# EAGLE schematic sboardnew (EAGLE 6.6.0)

## Sheet 1 of 5
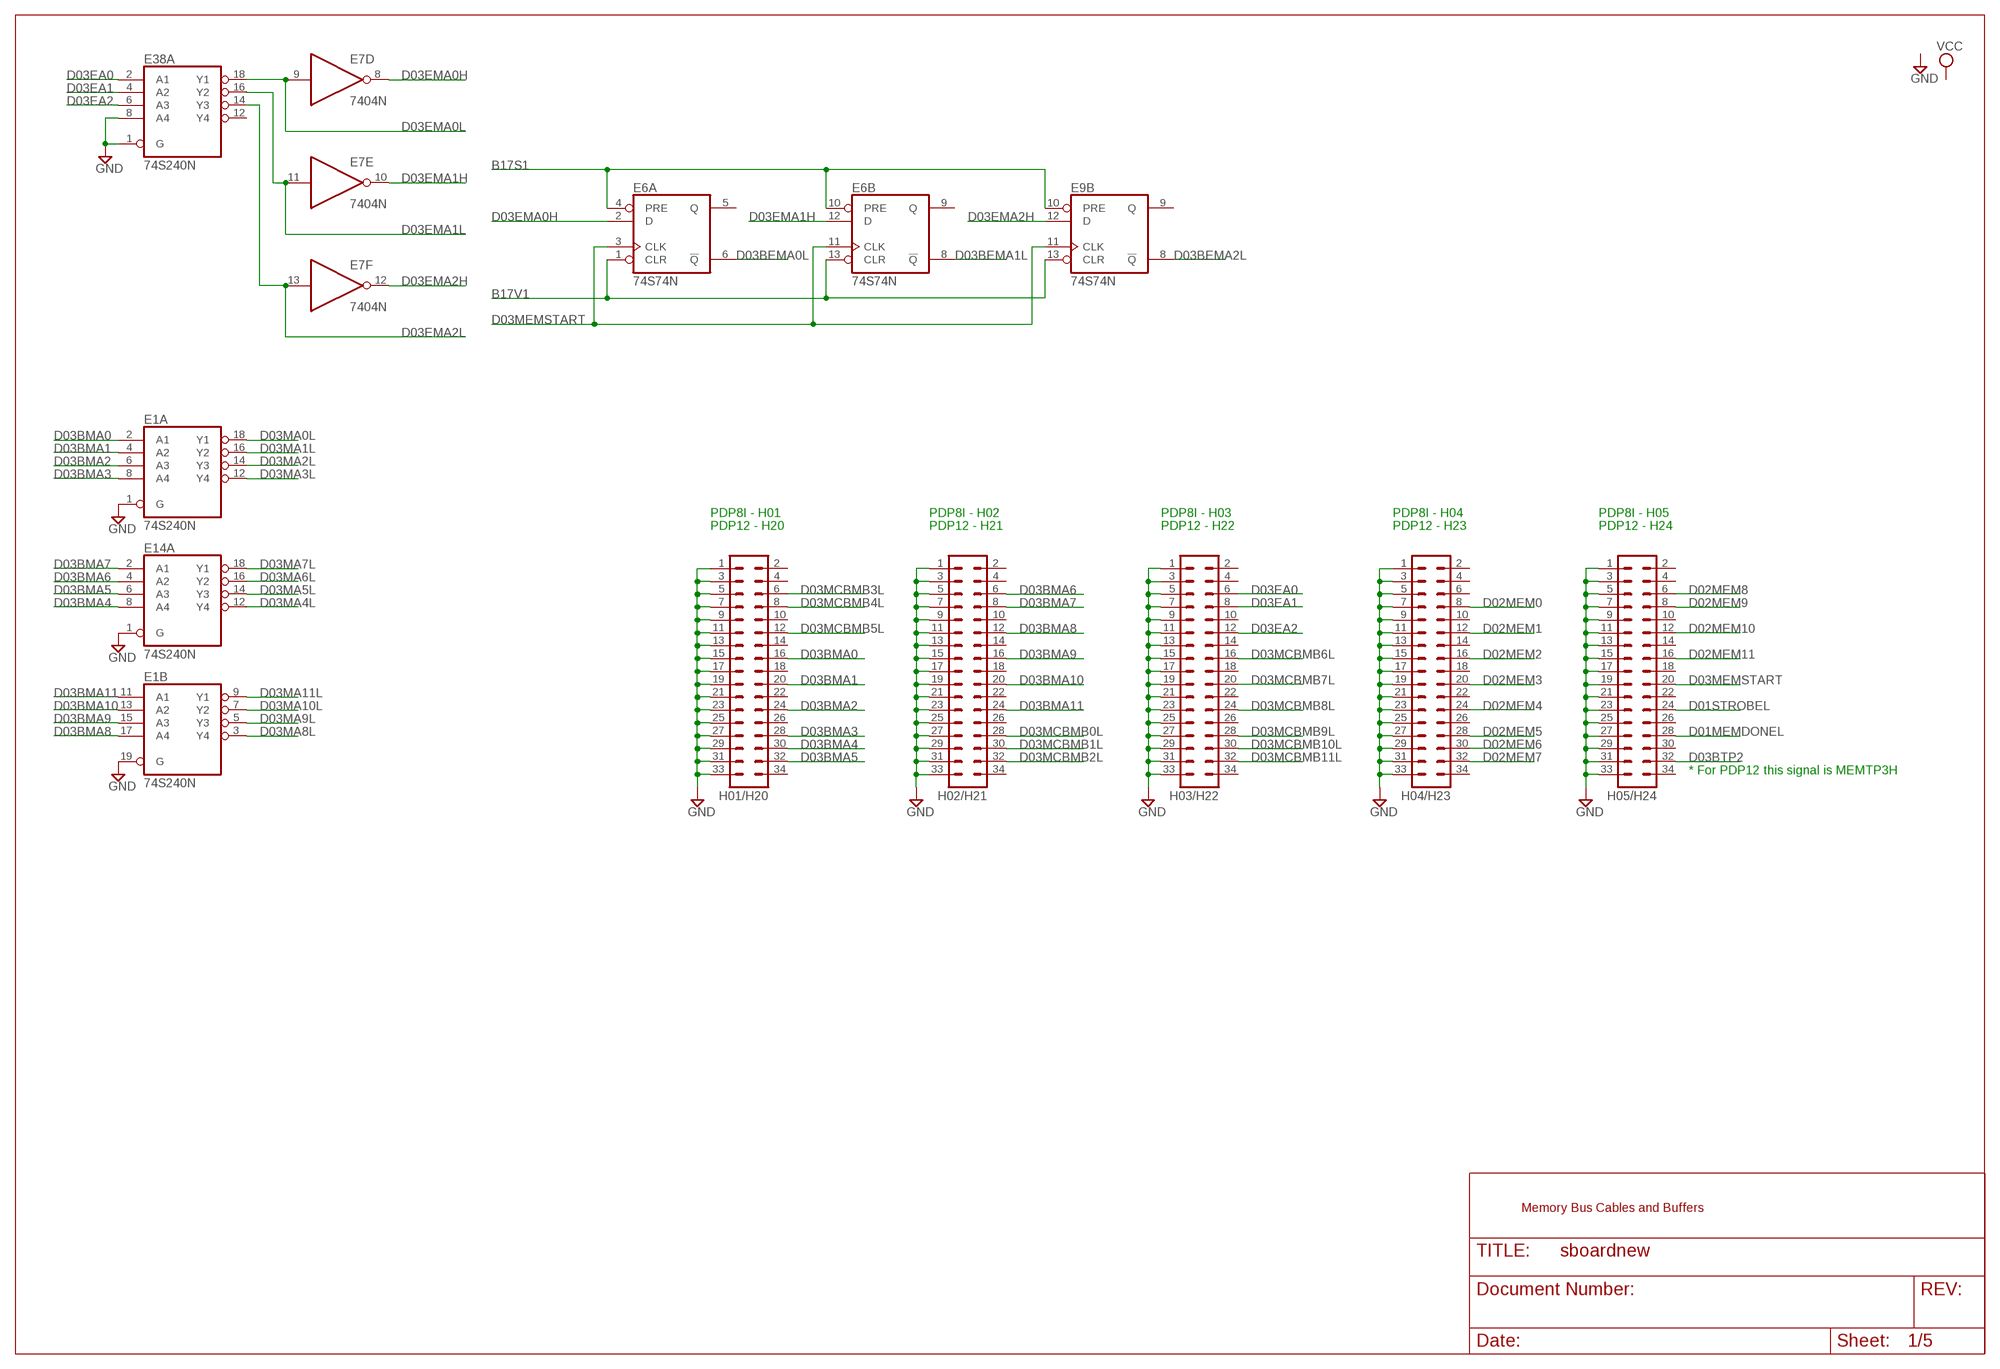
[diagram p0: schematic, sheet 1]

### Parts
E1  74S240N  [DIL20]
E6  74S74N  [DIL14]
E7  7404N  [DIL14]
E9  74S74N  [DIL14]
E14  74S240N  [DIL20]
E38  74S240N  [DIL20]
H01/H20  MA17-2  [MA17-2]
H02/H21  MA17-2  [MA17-2]
H03/H22  MA17-2  [MA17-2]
H04/H23  MA17-2  [MA17-2]
H05/H24  MA17-2  [MA17-2]

### Nets
B17S1: E6.4(A:PRE) E6.10(B:PRE) E9.10(B:PRE) ; also sheet 3,4
B17V1: E6.1(A:CLR) E6.13(B:CLR) E9.13(B:CLR) ; also sheet 3,4
D01MEMDONEL: H05/H24.28 ; also sheet 4
D01STROBEL: H05/H24.24 ; also sheet 4
D02MEM0: H04/H23.8 ; also sheet 3
D02MEM1: H04/H23.12 ; also sheet 3
D02MEM2: H04/H23.16 ; also sheet 3
D02MEM3: H04/H23.20 ; also sheet 3
D02MEM4: H04/H23.24 ; also sheet 3
D02MEM5: H04/H23.28 ; also sheet 3
D02MEM6: H04/H23.30 ; also sheet 3
D02MEM7: H04/H23.32 ; also sheet 3
D02MEM8: H05/H24.6 ; also sheet 3
D02MEM9: H05/H24.8 ; also sheet 3
D02MEM10: H05/H24.12 ; also sheet 3
D02MEM11: H05/H24.16 ; also sheet 3
D03BEMA0L: E6.6(A:!Q) ; also sheet 5
D03BEMA1L: E6.8(B:!Q) ; also sheet 5
D03BEMA2L: E9.8(B:!Q) ; also sheet 5
D03BMA0: E1.2(A:A1) H01/H20.16
D03BMA1: E1.4(A:A2) H01/H20.20
D03BMA2: E1.6(A:A3) H01/H20.24
D03BMA3: E1.8(A:A4) H01/H20.28
D03BMA4: E14.8(A:A4) H01/H20.30
D03BMA5: E14.6(A:A3) H01/H20.32
D03BMA6: E14.4(A:A2) H02/H21.6
D03BMA7: E14.2(A:A1) H02/H21.8
D03BMA8: E1.17(B:A4) H02/H21.12
D03BMA9: E1.15(B:A3) H02/H21.16
D03BMA10: E1.13(B:A2) H02/H21.20
D03BMA11: E1.11(B:A1) H02/H21.24
D03BTP2: H05/H24.32 ; also sheet 4
D03EA0: E38.2(A:A1) H03/H22.6
D03EA1: E38.4(A:A2) H03/H22.8
D03EA2: E38.6(A:A3) H03/H22.12
D03EMA0H: E6.2(A:D) E7.8(D:O) ; also sheet 4
D03EMA0L: E7.9(D:I) E38.18(A:Y1) ; also sheet 4
D03EMA1H: E6.12(B:D) E7.10(E:O) ; also sheet 4
D03EMA1L: E7.11(E:I) E38.16(A:Y2) ; also sheet 4
D03EMA2H: E7.12(F:O) E9.12(B:D) ; also sheet 4
D03EMA2L: E7.13(F:I) E38.14(A:Y3) ; also sheet 4
D03MA0L: E1.18(A:Y1) ; also sheet 5
D03MA1L: E1.16(A:Y2) ; also sheet 5
D03MA2L: E1.14(A:Y3) ; also sheet 5
D03MA3L: E1.12(A:Y4) ; also sheet 5
D03MA4L: E14.12(A:Y4) ; also sheet 5
D03MA5L: E14.14(A:Y3) ; also sheet 5
D03MA6L: E14.16(A:Y2) ; also sheet 5
D03MA7L: E14.18(A:Y1) ; also sheet 5
D03MA8L: E1.3(B:Y4) ; also sheet 5
D03MA9L: E1.5(B:Y3) ; also sheet 5
D03MA10L: E1.7(B:Y2) ; also sheet 5
D03MA11L: E1.9(B:Y1) ; also sheet 5
D03MCBMB0L: H02/H21.28 ; also sheet 2
D03MCBMB1L: H02/H21.30 ; also sheet 2
D03MCBMB2L: H02/H21.32 ; also sheet 2
D03MCBMB3L: H01/H20.6 ; also sheet 2
D03MCBMB4L: H01/H20.8 ; also sheet 2
D03MCBMB5L: H01/H20.12 ; also sheet 2
D03MCBMB6L: H03/H22.16 ; also sheet 2
D03MCBMB7L: H03/H22.20 ; also sheet 2
D03MCBMB8L: H03/H22.24 ; also sheet 2
D03MCBMB9L: H03/H22.28 ; also sheet 2
D03MCBMB10L: H03/H22.30 ; also sheet 2
D03MCBMB11L: H03/H22.32 ; also sheet 2
D03MEMSTART: E6.3(A:CLK) E6.11(B:CLK) E9.11(B:CLK) H05/H24.20 ; also sheet 4
GND [Power]: E1.1(A:G) E1.19(B:G) E14.1(A:G) E38.1(A:G) E38.8(A:A4) H01/H20.1 H01/H20.3 H01/H20.5 H01/H20.7 H01/H20.9 H01/H20.11 H01/H20.13 H01/H20.15 H01/H20.17 H01/H20.19 H01/H20.21 H01/H20.23 H01/H20.25 H01/H20.27 H01/H20.29 H01/H20.31 H01/H20.33 H02/H21.1 H02/H21.3 H02/H21.5 H02/H21.7 H02/H21.9 H02/H21.11 H02/H21.13 H02/H21.15 H02/H21.17 H02/H21.19 H02/H21.21 H02/H21.23 H02/H21.25 H02/H21.27 H02/H21.29 H02/H21.31 H02/H21.33 H03/H22.1 H03/H22.3 H03/H22.5 H03/H22.7 H03/H22.9 H03/H22.11 H03/H22.13 H03/H22.15 H03/H22.17 H03/H22.19 H03/H22.21 H03/H22.23 H03/H22.25 H03/H22.27 H03/H22.29 H03/H22.31 H03/H22.33 H04/H23.1 H04/H23.3 H04/H23.5 H04/H23.7 H04/H23.9 H04/H23.11 H04/H23.13 H04/H23.15 H04/H23.17 H04/H23.19 H04/H23.21 H04/H23.23 H04/H23.25 H04/H23.27 H04/H23.29 H04/H23.31 H04/H23.33 H05/H24.1 H05/H24.3 H05/H24.5 H05/H24.7 H05/H24.9 H05/H24.11 H05/H24.13 H05/H24.15 H05/H24.17 H05/H24.19 H05/H24.21 H05/H24.23 H05/H24.25 H05/H24.27 H05/H24.29 H05/H24.31 H05/H24.33 ; also sheet 3,4,5
Unconnected: E6.5(A:Q) E6.9(B:Q) E9.9(B:Q) E38.12(A:Y4) H01/H20.2 H01/H20.4 H01/H20.10 H01/H20.14 H01/H20.18 H01/H20.22 H01/H20.26 H01/H20.34 H02/H21.2 H02/H21.4 H02/H21.10 H02/H21.14 H02/H21.18 H02/H21.22 H02/H21.26 H02/H21.34 H03/H22.2 H03/H22.4 H03/H22.10 H03/H22.14 H03/H22.18 H03/H22.22 H03/H22.26 H03/H22.34 H04/H23.2 H04/H23.4 H04/H23.6 H04/H23.10 H04/H23.14 H04/H23.18 H04/H23.22 H04/H23.26 H04/H23.34 H05/H24.2 H05/H24.4 H05/H24.10 H05/H24.14 H05/H24.18 H05/H24.22 H05/H24.26 H05/H24.30 H05/H24.34

### Notes on the sheet
- PDP8I - H01 | PDP8I - H02 | PDP8I - H03 | PDP8I - H04 | PDP8I - H05
- PDP12 - H20 | PDP12 - H21 | PDP12 - H22 | PDP12 - H23 | PDP12 - H24
- * For PDP12 this signal is MEMTP3H
- Memory Bus Cables and Buffers

## Sheet 2 of 5
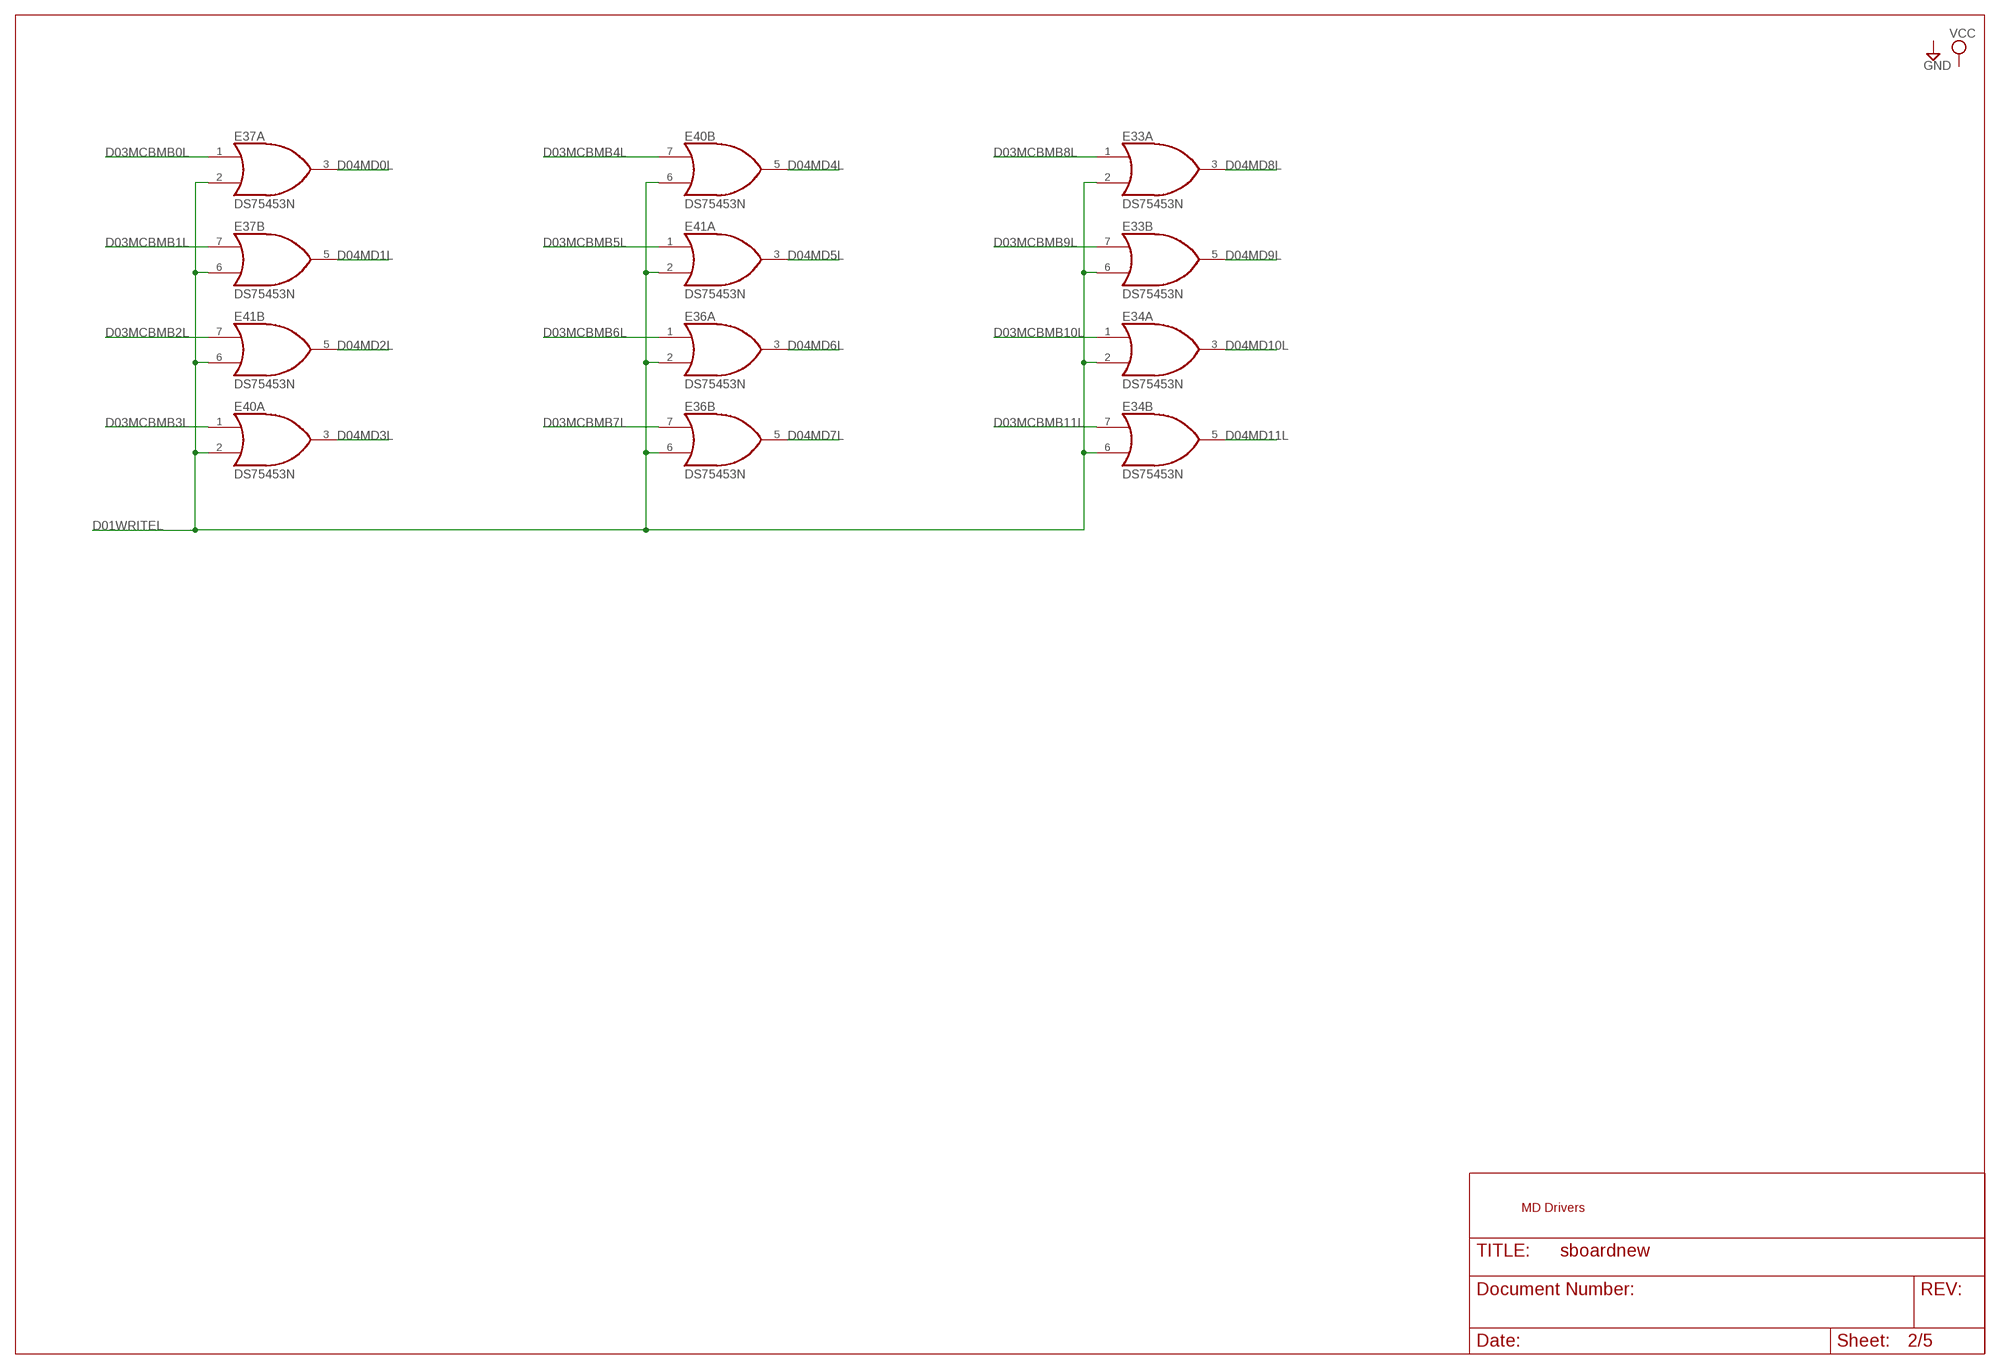
[diagram p1: schematic, sheet 2]

### Parts
E33  DS75453N  [DIL08]
E34  DS75453N  [DIL08]
E36  DS75453N  [DIL08]
E37  DS75453N  [DIL08]
E40  DS75453N  [DIL08]
E41  DS75453N  [DIL08]

### Nets
D01WRITEL: E33.2(A:I1) E33.6(B:I1) E34.2(A:I1) E34.6(B:I1) E36.2(A:I1) E36.6(B:I1) E37.2(A:I1) E37.6(B:I1) E40.2(A:I1) E40.6(B:I1) E41.2(A:I1) E41.6(B:I1) ; also sheet 3,5
D03MCBMB0L: E37.1(A:I0) ; also sheet 1
D03MCBMB1L: E37.7(B:I0) ; also sheet 1
D03MCBMB2L: E41.7(B:I0) ; also sheet 1
D03MCBMB3L: E40.1(A:I0) ; also sheet 1
D03MCBMB4L: E40.7(B:I0) ; also sheet 1
D03MCBMB5L: E41.1(A:I0) ; also sheet 1
D03MCBMB6L: E36.1(A:I0) ; also sheet 1
D03MCBMB7L: E36.7(B:I0) ; also sheet 1
D03MCBMB8L: E33.1(A:I0) ; also sheet 1
D03MCBMB9L: E33.7(B:I0) ; also sheet 1
D03MCBMB10L: E34.1(A:I0) ; also sheet 1
D03MCBMB11L: E34.7(B:I0) ; also sheet 1
D04MD0L: E37.3(A:O) ; also sheet 3,5
D04MD1L: E37.5(B:O) ; also sheet 3,5
D04MD2L: E41.5(B:O) ; also sheet 3,5
D04MD3L: E40.3(A:O) ; also sheet 3,5
D04MD4L: E40.5(B:O) ; also sheet 3,5
D04MD5L: E41.3(A:O) ; also sheet 3,5
D04MD6L: E36.3(A:O) ; also sheet 3,5
D04MD7L: E36.5(B:O) ; also sheet 3,5
D04MD8L: E33.3(A:O) ; also sheet 3,5
D04MD9L: E33.5(B:O) ; also sheet 3,5
D04MD10L: E34.3(A:O) ; also sheet 3,5
D04MD11L: E34.5(B:O) ; also sheet 3,5

### Notes on the sheet
- MD Drivers

## Sheet 3 of 5
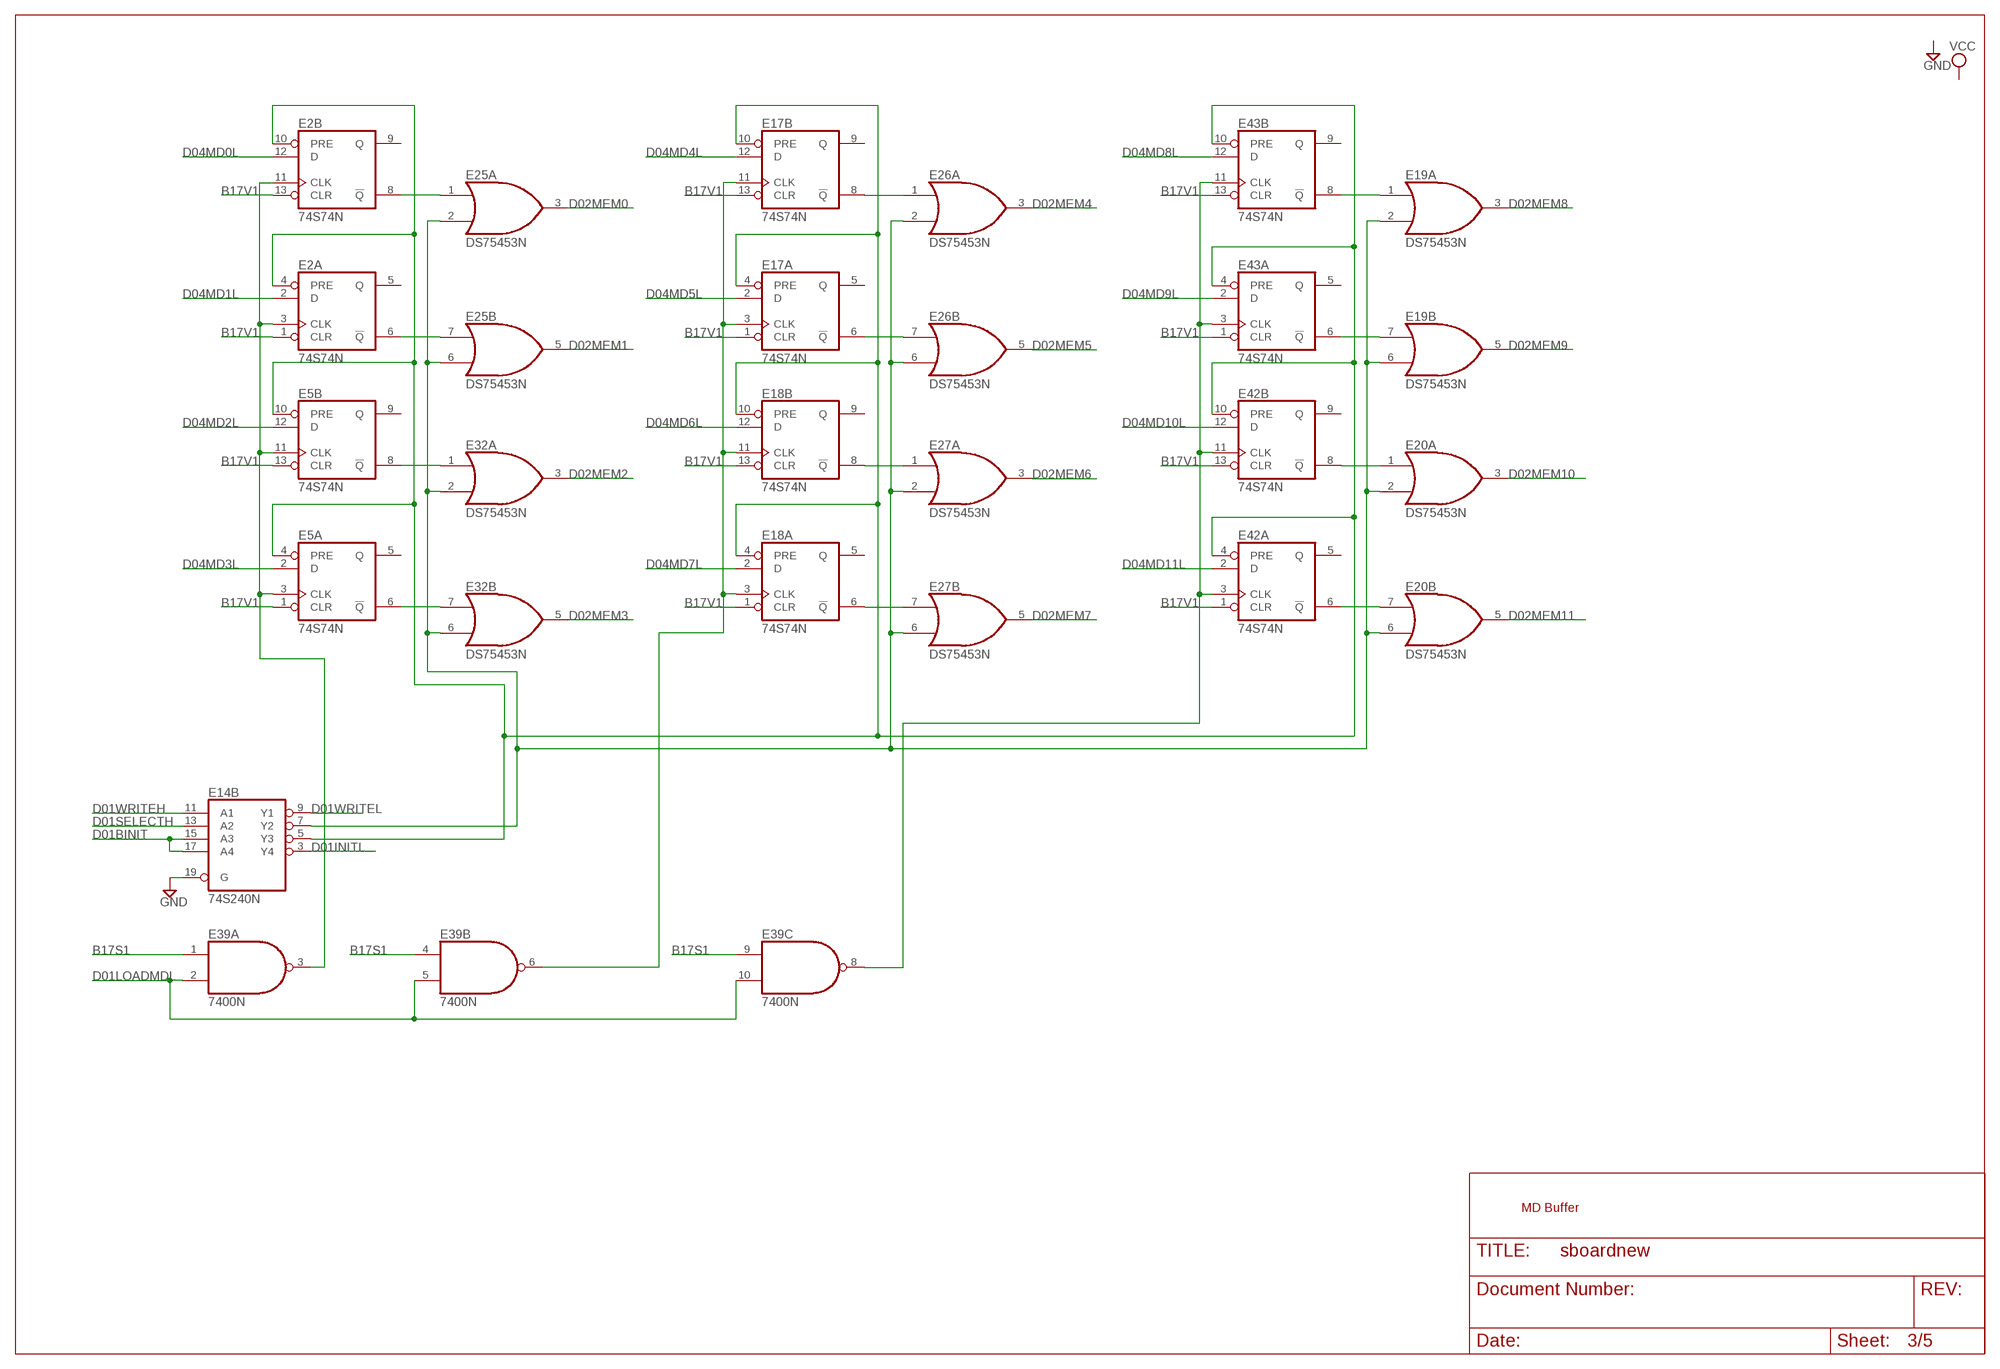
[diagram p2: schematic, sheet 3]

### Parts
E2  74S74N  [DIL14]
E5  74S74N  [DIL14]
E17  74S74N  [DIL14]
E18  74S74N  [DIL14]
E19  DS75453N  [DIL08]
E20  DS75453N  [DIL08]
E25  DS75453N  [DIL08]
E26  DS75453N  [DIL08]
E27  DS75453N  [DIL08]
E32  DS75453N  [DIL08]
E39  7400N  [DIL14]
E42  74S74N  [DIL14]
E43  74S74N  [DIL14]

### Nets
B17S1: E39.1(A:I0) E39.4(B:I0) E39.9(C:I0) ; also sheet 1,4
B17V1: E2.1(A:CLR) E2.13(B:CLR) E5.1(A:CLR) E5.13(B:CLR) E17.1(A:CLR) E17.13(B:CLR) E18.1(A:CLR) E18.13(B:CLR) E42.1(A:CLR) E42.13(B:CLR) E43.1(A:CLR) E43.13(B:CLR) ; also sheet 1,4
D01BINIT: E14.15(B:A3) E14.17(B:A4) ; also sheet 4
D01INITL: E14.3(B:Y4) ; also sheet 4
D01LOADMDL: E39.2(A:I1) E39.5(B:I1) E39.10(C:I1) ; also sheet 4
D01SELECTH: E14.13(B:A2) ; also sheet 4
D01WRITEH: E14.11(B:A1) ; also sheet 4
D01WRITEL: E14.9(B:Y1) ; also sheet 2,5
D02MEM0: E25.3(A:O) ; also sheet 1
D02MEM1: E25.5(B:O) ; also sheet 1
D02MEM2: E32.3(A:O) ; also sheet 1
D02MEM3: E32.5(B:O) ; also sheet 1
D02MEM4: E26.3(A:O) ; also sheet 1
D02MEM5: E26.5(B:O) ; also sheet 1
D02MEM6: E27.3(A:O) ; also sheet 1
D02MEM7: E27.5(B:O) ; also sheet 1
D02MEM8: E19.3(A:O) ; also sheet 1
D02MEM9: E19.5(B:O) ; also sheet 1
D02MEM10: E20.3(A:O) ; also sheet 1
D02MEM11: E20.5(B:O) ; also sheet 1
D04MD0L: E2.12(B:D) ; also sheet 2,5
D04MD1L: E2.2(A:D) ; also sheet 2,5
D04MD2L: E5.12(B:D) ; also sheet 2,5
D04MD3L: E5.2(A:D) ; also sheet 2,5
D04MD4L: E17.12(B:D) ; also sheet 2,5
D04MD5L: E17.2(A:D) ; also sheet 2,5
D04MD6L: E18.12(B:D) ; also sheet 2,5
D04MD7L: E18.2(A:D) ; also sheet 2,5
D04MD8L: E43.12(B:D) ; also sheet 2,5
D04MD9L: E43.2(A:D) ; also sheet 2,5
D04MD10L: E42.12(B:D) ; also sheet 2,5
D04MD11L: E42.2(A:D) ; also sheet 2,5
GND [Power]: E14.19(B:G) ; also sheet 1,4,5
N$8: E2.3(A:CLK) E2.11(B:CLK) E5.3(A:CLK) E5.11(B:CLK) E39.3(A:O)
N$12: E5.6(A:!Q) E32.7(B:I0)
N$14: E2.8(B:!Q) E25.1(A:I0)
N$15: E2.6(A:!Q) E25.7(B:I0)
N$16: E17.3(A:CLK) E17.11(B:CLK) E18.3(A:CLK) E18.11(B:CLK) E39.6(B:O)
N$17: E5.8(B:!Q) E32.1(A:I0)
N$21: E2.4(A:PRE) E2.10(B:PRE) E5.4(A:PRE) E5.10(B:PRE) E14.5(B:Y3) E17.4(A:PRE) E17.10(B:PRE) E18.4(A:PRE) E18.10(B:PRE) E42.4(A:PRE) E42.10(B:PRE) E43.4(A:PRE) E43.10(B:PRE)
N$22: E14.7(B:Y2) E19.2(A:I1) E19.6(B:I1) E20.2(A:I1) E20.6(B:I1) E25.2(A:I1) E25.6(B:I1) E26.2(A:I1) E26.6(B:I1) E27.2(A:I1) E27.6(B:I1) E32.2(A:I1) E32.6(B:I1)
N$24: E17.6(A:!Q) E26.7(B:I0)
N$25: E18.6(A:!Q) E27.7(B:I0)
N$26: E18.8(B:!Q) E27.1(A:I0)
N$27: E17.8(B:!Q) E26.1(A:I0)
N$29: E20.7(B:I0) E42.6(A:!Q)
N$30: E20.1(A:I0) E42.8(B:!Q)
N$41: E39.8(C:O) E42.3(A:CLK) E42.11(B:CLK) E43.3(A:CLK) E43.11(B:CLK)
N$67: E19.7(B:I0) E43.6(A:!Q)
N$68: E19.1(A:I0) E43.8(B:!Q)
Unconnected: E2.5(A:Q) E2.9(B:Q) E5.5(A:Q) E5.9(B:Q) E17.5(A:Q) E17.9(B:Q) E18.5(A:Q) E18.9(B:Q) E42.5(A:Q) E42.9(B:Q) E43.5(A:Q) E43.9(B:Q)

### Notes on the sheet
- MD Buffer

## Sheet 4 of 5
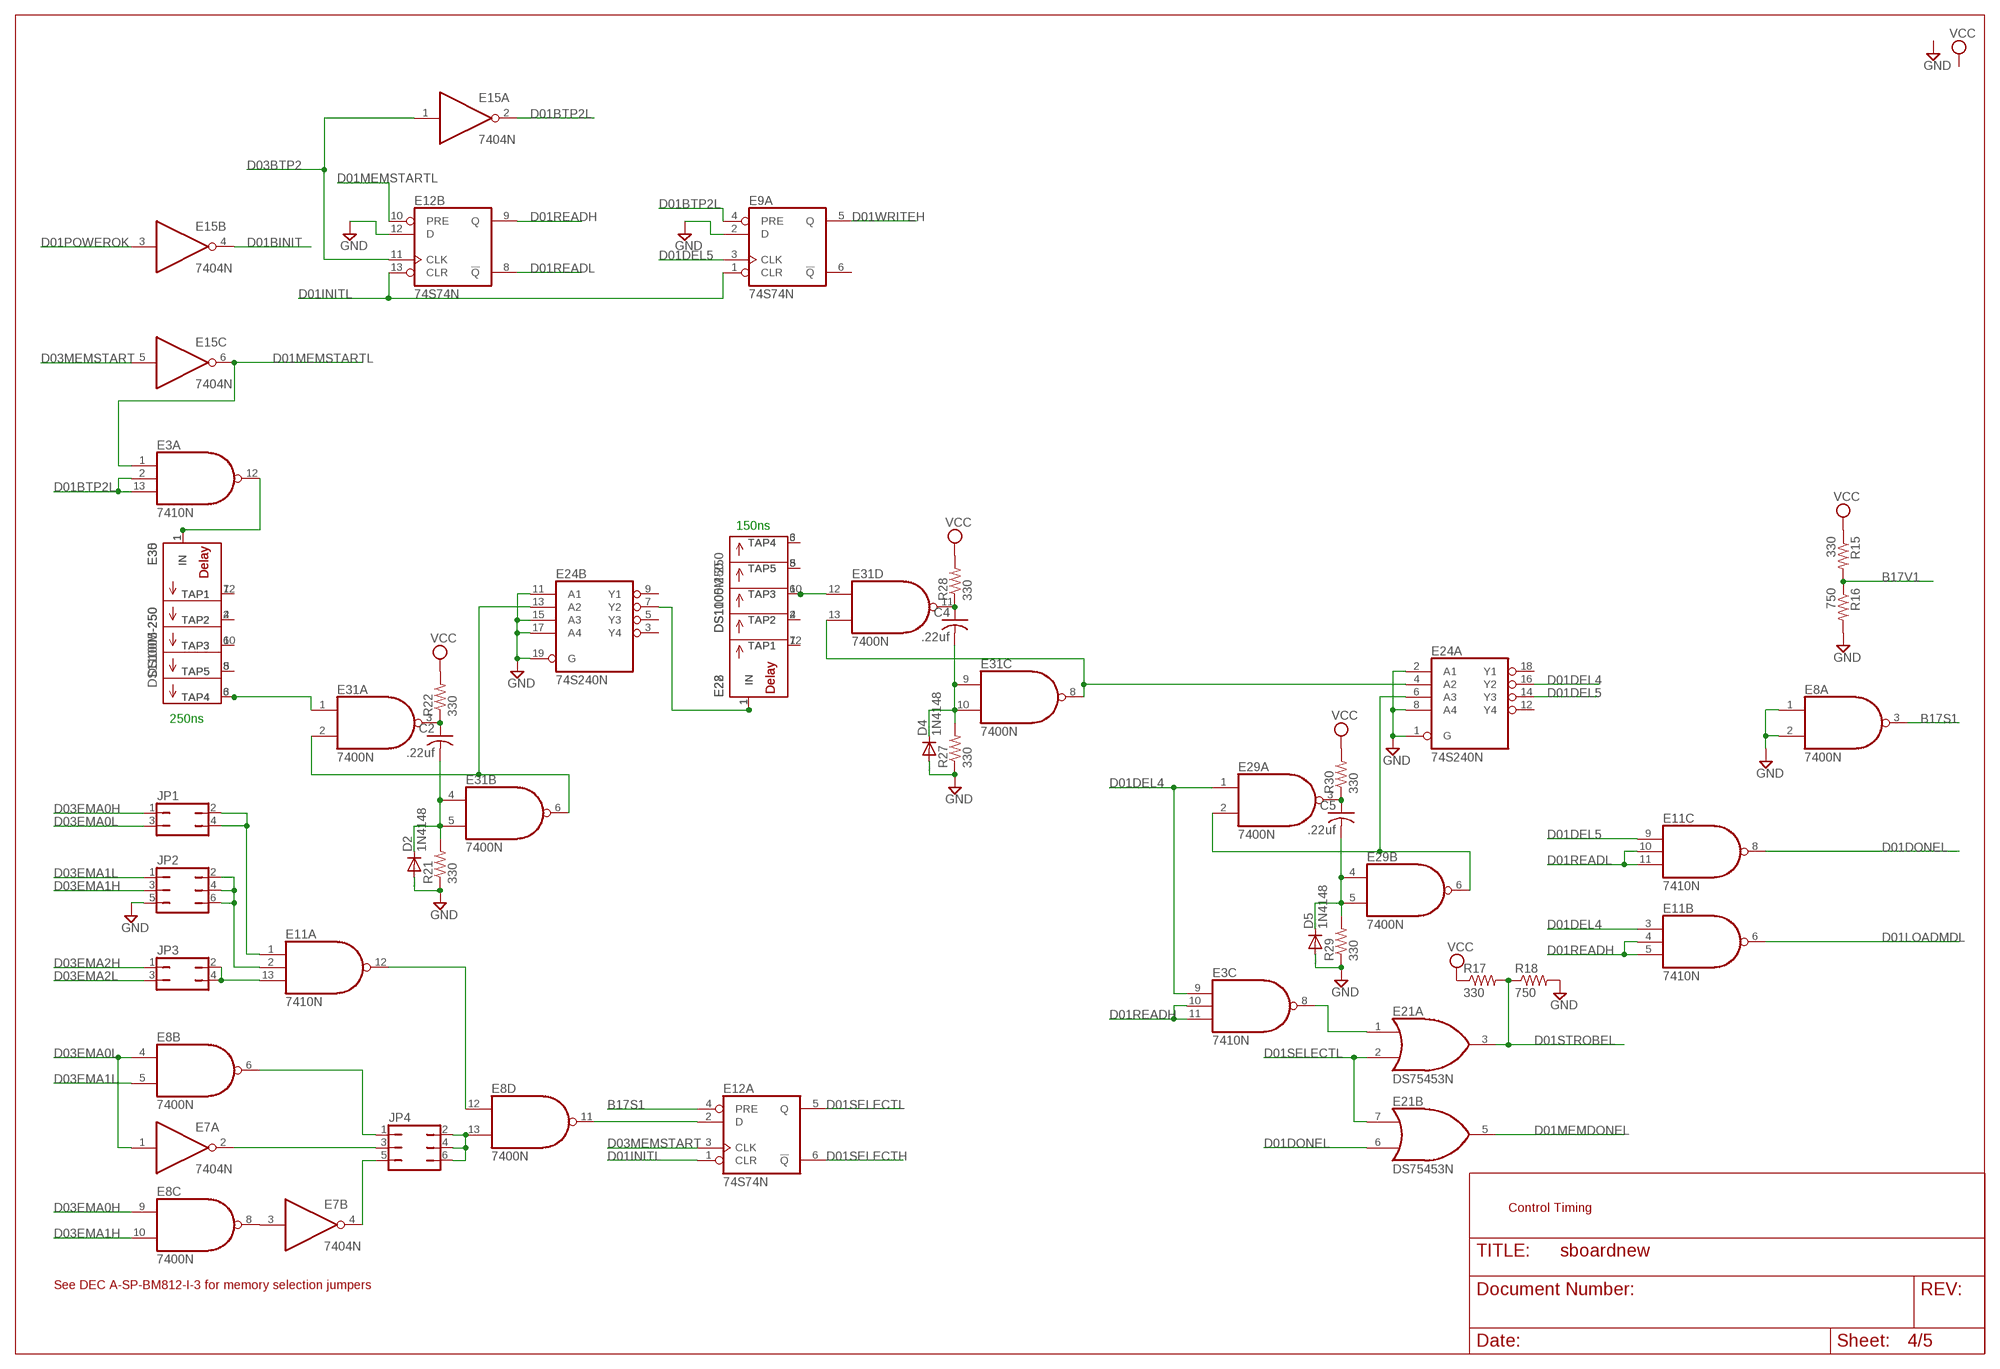
[diagram p3: schematic, sheet 4]

### Parts
C2  .22uf  C-US050-025X075  [C050-025X075]
C4  .22uf  C-US050-025X075  [C050-025X075]
C5  .22uf  C-US050-025X075  [C050-025X075]
D2  1N4148  1N4148DO35-10  [DO35-10]
D4  1N4148  1N4148DO35-10  [DO35-10]
D5  1N4148  1N4148DO35-10  [DO35-10]
E3  7410N  [DIL14]
E8  7400N  [DIL14]
E11  7410N  [DIL14]
E12  74S74N  [DIL14]
E15  7404N  [DIL14]
E21  DS75453N  [DIL08]
E22  DS1100M-250  MXD1000  [DIL08]
E24  74S240N  [DIL20]
E28  DS1005-250  MXD1000P  [DIL14]
E29  7400N  [DIL14]
E30  DS1005-250  MXD1000P  [DIL14]
E31  7400N  [DIL14]
E35  DS1100M-250  MXD1000  [DIL08]
JP1  JP2Q  [JP2Q]
JP2  JP3Q  [JP3Q]
JP3  JP2Q  [JP2Q]
JP4  JP3Q  [JP3Q]
R15  330  R-US_0207/10  [0207/10]
R16  750  R-US_0207/10  [0207/10]
R17  330  R-US_0207/10  [0207/10]
R18  750  R-US_0207/10  [0207/10]
R21  330  R-US_0207/10  [0207/10]
R22  330  R-US_0207/10  [0207/10]
R27  330  R-US_0207/10  [0207/10]
R28  330  R-US_0207/10  [0207/10]
R29  330  R-US_0207/10  [0207/10]
R30  330  R-US_0207/10  [0207/10]

### Nets
B17S1: E8.3(A:O) E12.4(A:PRE) ; also sheet 1,3
B17V1: R15.2 R16.1 ; also sheet 1,3
D01BINIT: E15.4(B:O) ; also sheet 3
D01BTP2L: E3.2(A:I1) E3.13(A:I2) E9.4(A:PRE) E15.2(A:O)
D01DEL2X: E22.1(IN) E24.7(B:Y2) E28.1(IN)
D01DEL4: E3.9(C:I0) E11.3(B:I0) E24.16(A:Y2) E29.1(A:I0)
D01DEL5: E9.3(A:CLK) E11.9(C:I0) E24.14(A:Y3)
D01DONEL: E11.8(C:O) E21.6(B:I1)
D01INITL: E9.1(A:CLR) E12.1(A:CLR) E12.13(B:CLR) ; also sheet 3
D01LOADMDL: E11.6(B:O) ; also sheet 3
D01MEMDONEL: E21.5(B:O) ; also sheet 1
D01MEMSTARTL: E3.1(A:I0) E12.10(B:PRE) E15.6(C:O)
D01POWEROK: E15.3(B:I) ; also sheet 5
D01READH: E3.10(C:I1) E3.11(C:I2) E11.4(B:I1) E11.5(B:I2) E12.9(B:Q)
D01READL: E11.10(C:I1) E11.11(C:I2) E12.8(B:!Q) ; also sheet 5
D01SELECTH: E12.6(A:!Q) ; also sheet 3
D01SELECTL: E12.5(A:Q) E21.2(A:I1) E21.7(B:I0)
D01SELL: E8.11(D:O) E12.2(A:D)
D01STROBEL: E21.3(A:O) R17.2 R18.1 ; also sheet 1
D01WRITEH: E9.5(A:Q) ; also sheet 3
D03BTP2: E12.11(B:CLK) E15.1(A:I) ; also sheet 1
D03EMA0H: E8.9(C:I0) JP1.1 ; also sheet 1
D03EMA0L: E7.1(A:I) E8.4(B:I0) JP1.3 ; also sheet 1
D03EMA1H: E8.10(C:I1) JP2.3 ; also sheet 1
D03EMA1L: E8.5(B:I1) JP2.1 ; also sheet 1
D03EMA2H: JP3.1 ; also sheet 1
D03EMA2L: JP3.3 ; also sheet 1
D03MEMSTART: E12.3(A:CLK) E15.5(C:I) ; also sheet 1
GND [Power]: D2.A D4.A D5.A E8.1(A:I0) E8.2(A:I1) E9.2(A:D) E12.12(B:D) E24.1(A:G) E24.2(A:A1) E24.8(A:A4) E24.11(B:A1) E24.15(B:A3) E24.17(B:A4) E24.19(B:G) JP2.5 R16.2 R18.2 R21.1 R27.1 R29.1 ; also sheet 1,3,5
N$2: E22.2(TAP2) E28.4(TAP2)
N$5: C5.2 D5.C E29.4(B:I0) E29.5(B:I1) R29.2
N$7: E8.13(D:I1) JP4.2 JP4.4 JP4.6
N$9: C2.2 D2.C E31.4(B:I0) E31.5(B:I1) R21.2
N$10: E30.12(TAP1) E35.7(TAP1)
N$20: C2.1 E31.3(A:O) R22.1
N$23: E24.13(B:A2) E31.2(A:I1) E31.6(B:O)
N$31: E30.6(TAP4) E31.1(A:I0) E35.3(TAP4)
N$33: C4.2 D4.C E31.9(C:I0) E31.10(C:I1) R27.2
N$34: C4.1 E31.11(D:O) R28.1
N$35: E3.12(A:O) E30.1(IN) E35.1(IN)
N$37: E24.4(A:A2) E31.8(C:O) E31.13(D:I1)
N$38: E22.6(TAP3) E28.10(TAP3) E31.12(D:I0)
N$39: C5.1 E29.3(A:O) R30.1
N$40: E24.6(A:A3) E29.2(A:I1) E29.6(B:O)
N$48: E22.7(TAP1) E28.12(TAP1)
N$49: E22.3(TAP4) E28.6(TAP4)
N$50: E22.5(TAP5) E28.8(TAP5)
N$51: E30.4(TAP2) E35.2(TAP2)
N$52: E30.10(TAP3) E35.6(TAP3)
N$53: E30.8(TAP5) E35.5(TAP5)
N$73: E8.6(B:O) JP4.1
N$94: E3.8(C:O) E21.1(A:I0)
N$103: E7.2(A:O) JP4.3
N$108: E7.3(B:I) E8.8(C:O)
N$111: E7.4(B:O) JP4.5
N$113: E11.13(A:I2) JP3.2 JP3.4
N$128: E11.2(A:I1) JP2.2 JP2.4 JP2.6
N$129: E11.1(A:I0) JP1.2 JP1.4
N$132: E8.12(D:I0) E11.12(A:O)
VCC [Power]: R15.1 R17.1 R22.2 R28.2 R30.2 ; also sheet 5
Unconnected: E9.6(A:!Q) E24.3(B:Y4) E24.5(B:Y3) E24.9(B:Y1) E24.12(A:Y4) E24.18(A:Y1) E28.2(NC) E28.3(NC) E28.5(NC) E28.9(NC) E28.11(NC) E28.13(NC) E30.2(NC) E30.3(NC) E30.5(NC) E30.9(NC) E30.11(NC) E30.13(NC)

### Notes on the sheet
- 150ns
- 250ns
- Control Timing
- See DEC A-SP-BM812-I-3 for memory selection jumpers

## Sheet 5 of 5
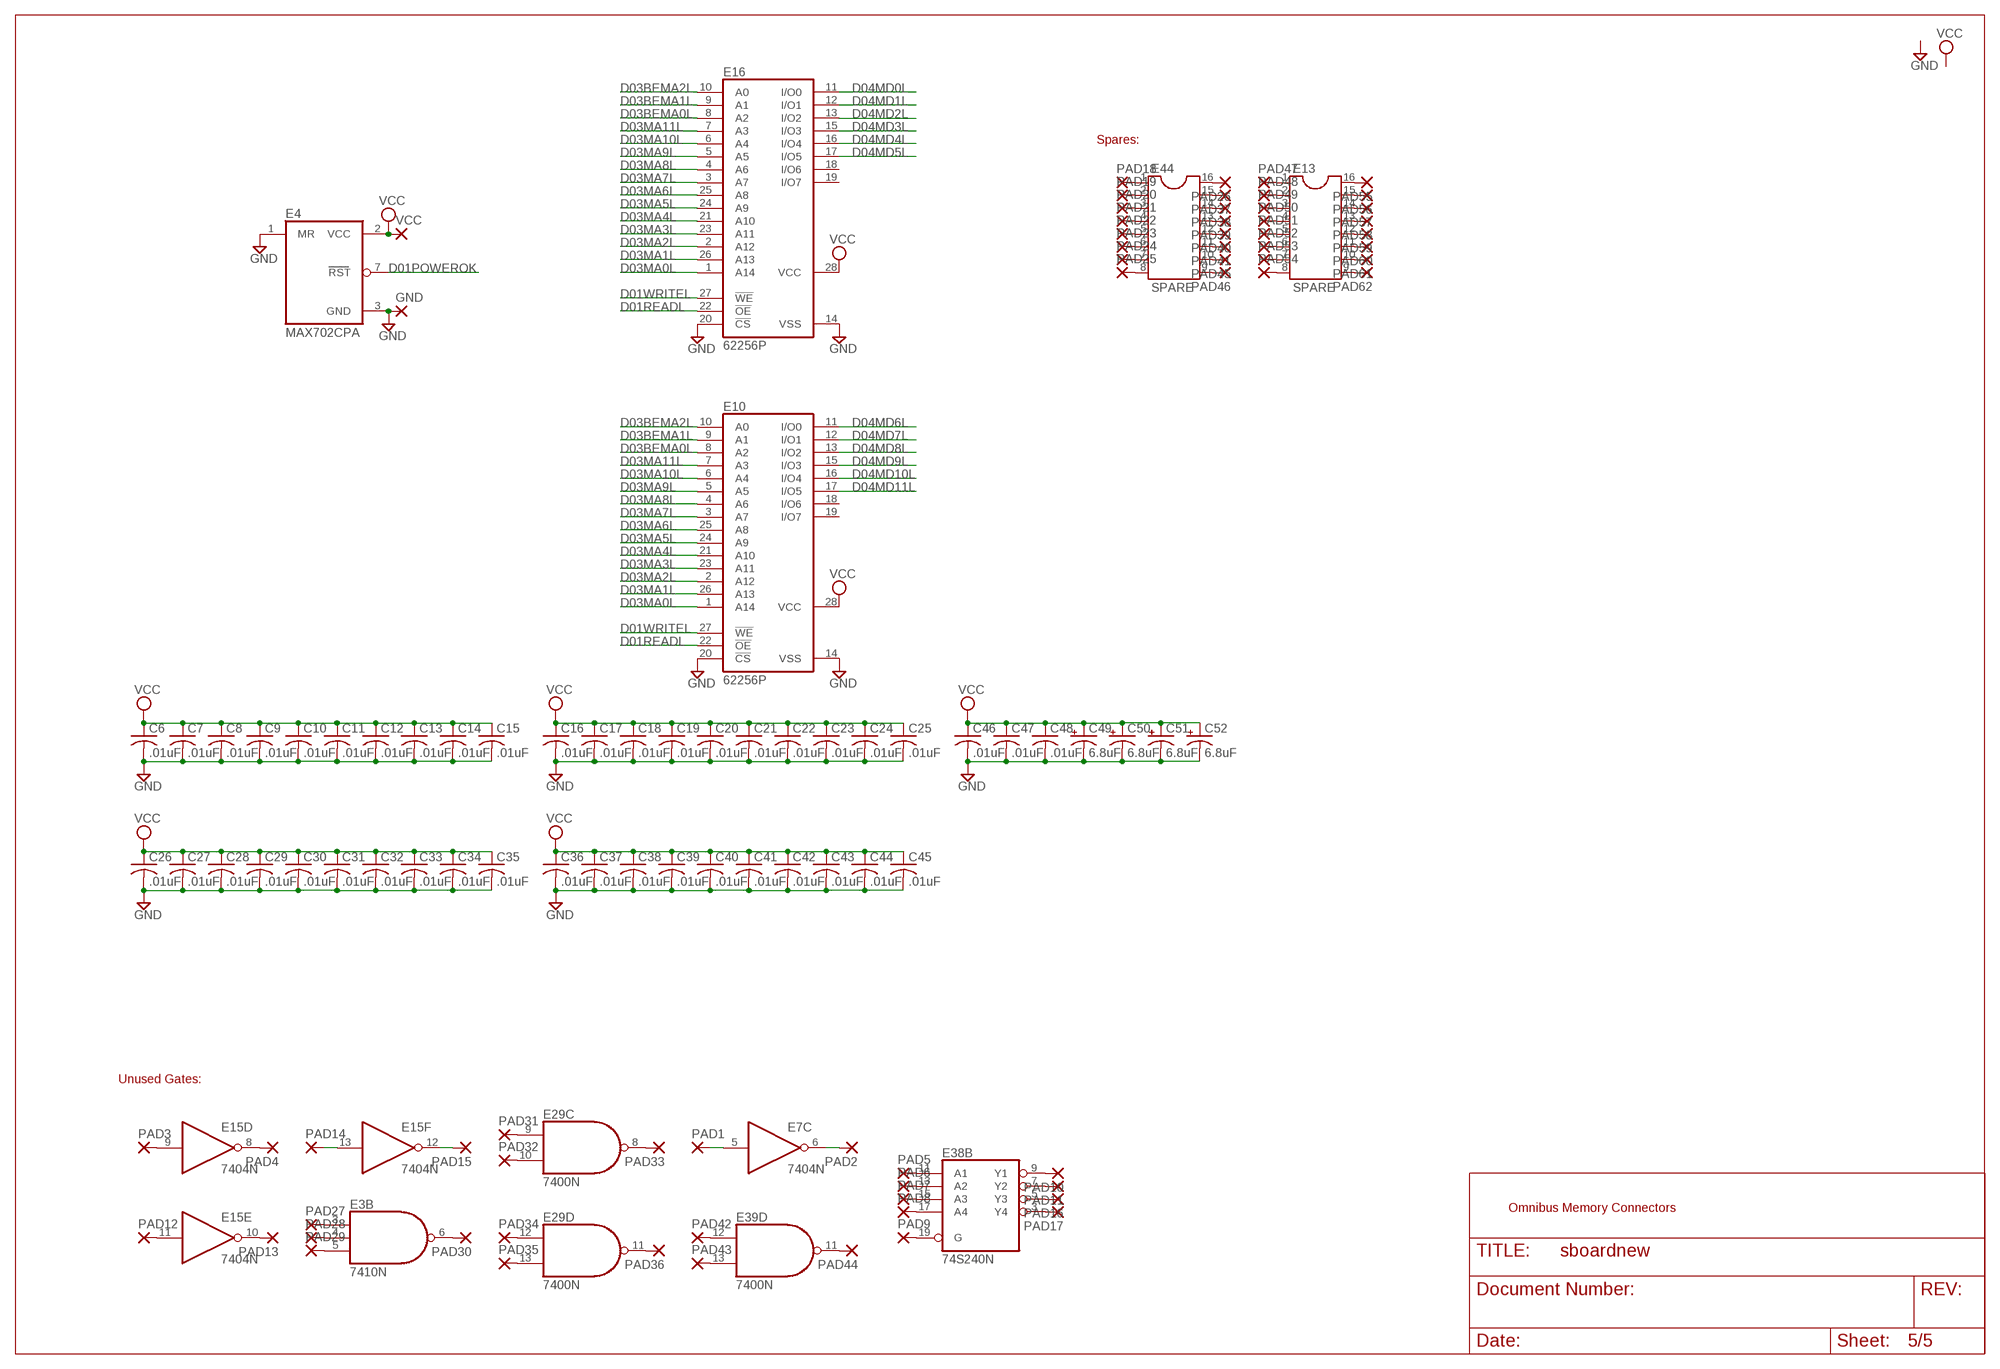
[diagram p4: schematic, sheet 5]

### Parts
C6  .01uF  C-US050-025X075  [C050-025X075]
C7  .01uF  C-US050-025X075  [C050-025X075]
C8  .01uF  C-US050-025X075  [C050-025X075]
C9  .01uF  C-US050-025X075  [C050-025X075]
C10  .01uF  C-US050-025X075  [C050-025X075]
C11  .01uF  C-US050-025X075  [C050-025X075]
C12  .01uF  C-US050-025X075  [C050-025X075]
C13  .01uF  C-US050-025X075  [C050-025X075]
C14  .01uF  C-US050-025X075  [C050-025X075]
C15  .01uF  C-US050-025X075  [C050-025X075]
C16  .01uF  C-US050-025X075  [C050-025X075]
C17  .01uF  C-US050-025X075  [C050-025X075]
C18  .01uF  C-US050-025X075  [C050-025X075]
C19  .01uF  C-US050-025X075  [C050-025X075]
C20  .01uF  C-US050-025X075  [C050-025X075]
C21  .01uF  C-US050-025X075  [C050-025X075]
C22  .01uF  C-US050-025X075  [C050-025X075]
C23  .01uF  C-US050-025X075  [C050-025X075]
C24  .01uF  C-US050-025X075  [C050-025X075]
C25  .01uF  C-US050-025X075  [C050-025X075]
C26  .01uF  C-US050-025X075  [C050-025X075]
C27  .01uF  C-US050-025X075  [C050-025X075]
C28  .01uF  C-US050-025X075  [C050-025X075]
C29  .01uF  C-US050-025X075  [C050-025X075]
C30  .01uF  C-US050-025X075  [C050-025X075]
C31  .01uF  C-US050-025X075  [C050-025X075]
C32  .01uF  C-US050-025X075  [C050-025X075]
C33  .01uF  C-US050-025X075  [C050-025X075]
C34  .01uF  C-US050-025X075  [C050-025X075]
C35  .01uF  C-US050-025X075  [C050-025X075]
C36  .01uF  C-US050-025X075  [C050-025X075]
C37  .01uF  C-US050-025X075  [C050-025X075]
C38  .01uF  C-US050-025X075  [C050-025X075]
C39  .01uF  C-US050-025X075  [C050-025X075]
C40  .01uF  C-US050-025X075  [C050-025X075]
C41  .01uF  C-US050-025X075  [C050-025X075]
C42  .01uF  C-US050-025X075  [C050-025X075]
C43  .01uF  C-US050-025X075  [C050-025X075]
C44  .01uF  C-US050-025X075  [C050-025X075]
C45  .01uF  C-US050-025X075  [C050-025X075]
C46  .01uF  C-US050-025X075  [C050-025X075]
C47  .01uF  C-US050-025X075  [C050-025X075]
C48  .01uF  C-US050-025X075  [C050-025X075]
C49  6.8uF  CPOL-USE22-6AXIAL  [E22-6]
C50  6.8uF  CPOL-USE22-6AXIAL  [E22-6]
C51  6.8uF  CPOL-USE22-6AXIAL  [E22-6]
C52  6.8uF  CPOL-USE22-6AXIAL  [E22-6]
E4  MAX702CPA  [DIL08]
E10  62256P  [DIL28-6]
E13  SPARE  DIL16  [DIL16]
E16  62256P  [DIL28-6]
E44  SPARE  DIL16  [DIL16]
GND  2,15/1,0  [2,15/1,0]
PAD1  1,6/0,8  [1,6/0,8]
PAD2  1,6/0,8  [1,6/0,8]
PAD3  1,6/0,8  [1,6/0,8]
PAD4  1,6/0,8  [1,6/0,8]
PAD5  1,6/0,8  [1,6/0,8]
PAD6  1,6/0,8  [1,6/0,8]
PAD7  1,6/0,8  [1,6/0,8]
PAD8  1,6/0,8  [1,6/0,8]
PAD9  1,6/0,8  [1,6/0,8]
PAD10  1,6/0,8  [1,6/0,8]
PAD11  1,6/0,8  [1,6/0,8]
PAD12  1,6/0,8  [1,6/0,8]
PAD13  1,6/0,8  [1,6/0,8]
PAD14  1,6/0,8  [1,6/0,8]
PAD15  1,6/0,8  [1,6/0,8]
PAD16  1,6/0,8  [1,6/0,8]
PAD17  1,6/0,8  [1,6/0,8]
PAD18  1,6/0,8  [1,6/0,8]
PAD19  1,6/0,8  [1,6/0,8]
PAD20  1,6/0,8  [1,6/0,8]
PAD21  1,6/0,8  [1,6/0,8]
PAD22  1,6/0,8  [1,6/0,8]
PAD23  1,6/0,8  [1,6/0,8]
PAD24  1,6/0,8  [1,6/0,8]
PAD25  1,6/0,8  [1,6/0,8]
PAD26  1,6/0,8  [1,6/0,8]
PAD27  1,6/0,8  [1,6/0,8]
PAD28  1,6/0,8  [1,6/0,8]
PAD29  1,6/0,8  [1,6/0,8]
PAD30  1,6/0,8  [1,6/0,8]
PAD31  1,6/0,8  [1,6/0,8]
PAD32  1,6/0,8  [1,6/0,8]
PAD33  1,6/0,8  [1,6/0,8]
PAD34  1,6/0,8  [1,6/0,8]
PAD35  1,6/0,8  [1,6/0,8]
PAD36  1,6/0,8  [1,6/0,8]
PAD37  1,6/0,8  [1,6/0,8]
PAD38  1,6/0,8  [1,6/0,8]
PAD39  1,6/0,8  [1,6/0,8]
PAD40  1,6/0,8  [1,6/0,8]
PAD41  1,6/0,8  [1,6/0,8]
PAD42  1,6/0,8  [1,6/0,8]
PAD43  1,6/0,8  [1,6/0,8]
PAD44  1,6/0,8  [1,6/0,8]
PAD45  1,6/0,8  [1,6/0,8]
PAD46  1,6/0,8  [1,6/0,8]
PAD47  1,6/0,8  [1,6/0,8]
PAD48  1,6/0,8  [1,6/0,8]
PAD49  1,6/0,8  [1,6/0,8]
PAD50  1,6/0,8  [1,6/0,8]
PAD51  1,6/0,8  [1,6/0,8]
PAD52  1,6/0,8  [1,6/0,8]
PAD53  1,6/0,8  [1,6/0,8]
PAD54  1,6/0,8  [1,6/0,8]
PAD55  1,6/0,8  [1,6/0,8]
PAD56  1,6/0,8  [1,6/0,8]
PAD57  1,6/0,8  [1,6/0,8]
PAD58  1,6/0,8  [1,6/0,8]
PAD59  1,6/0,8  [1,6/0,8]
PAD60  1,6/0,8  [1,6/0,8]
PAD61  1,6/0,8  [1,6/0,8]
PAD62  1,6/0,8  [1,6/0,8]
VCC  2,15/1,0  [2,15/1,0]

### Nets
D01POWEROK: E4.7(RST) ; also sheet 4
D01READL: E10.22(!OE) E16.22(!OE) ; also sheet 4
D01WRITEL: E10.27(!WE) E16.27(!WE) ; also sheet 2,3
D03BEMA0L: E10.8(A2) E16.8(A2) ; also sheet 1
D03BEMA1L: E10.9(A1) E16.9(A1) ; also sheet 1
D03BEMA2L: E10.10(A0) E16.10(A0) ; also sheet 1
D03MA0L: E10.1(A14) E16.1(A14) ; also sheet 1
D03MA1L: E10.26(A13) E16.26(A13) ; also sheet 1
D03MA2L: E10.2(A12) E16.2(A12) ; also sheet 1
D03MA3L: E10.23(A11) E16.23(A11) ; also sheet 1
D03MA4L: E10.21(A10) E16.21(A10) ; also sheet 1
D03MA5L: E10.24(A9) E16.24(A9) ; also sheet 1
D03MA6L: E10.25(A8) E16.25(A8) ; also sheet 1
D03MA7L: E10.3(A7) E16.3(A7) ; also sheet 1
D03MA8L: E10.4(A6) E16.4(A6) ; also sheet 1
D03MA9L: E10.5(A5) E16.5(A5) ; also sheet 1
D03MA10L: E10.6(A4) E16.6(A4) ; also sheet 1
D03MA11L: E10.7(A3) E16.7(A3) ; also sheet 1
D04MD0L: E16.11(I/O0) ; also sheet 2,3
D04MD1L: E16.12(I/O1) ; also sheet 2,3
D04MD2L: E16.13(I/O2) ; also sheet 2,3
D04MD3L: E16.15(I/O3) ; also sheet 2,3
D04MD4L: E16.16(I/O4) ; also sheet 2,3
D04MD5L: E16.17(I/O5) ; also sheet 2,3
D04MD6L: E10.11(I/O0) ; also sheet 2,3
D04MD7L: E10.12(I/O1) ; also sheet 2,3
D04MD8L: E10.13(I/O2) ; also sheet 2,3
D04MD9L: E10.15(I/O3) ; also sheet 2,3
D04MD10L: E10.16(I/O4) ; also sheet 2,3
D04MD11L: E10.17(I/O5) ; also sheet 2,3
GND [Power]: C6.2 C7.2 C8.2 C9.2 C10.2 C11.2 C12.2 C13.2 C14.2 C15.2 C16.2 C17.2 C18.2 C19.2 C20.2 C21.2 C22.2 C23.2 C24.2 C25.2 C26.2 C27.2 C28.2 C29.2 C30.2 C31.2 C32.2 C33.2 C34.2 C35.2 C36.2 C37.2 C38.2 C39.2 C40.2 C41.2 C42.2 C43.2 C44.2 C45.2 C46.2 C47.2 C48.2 C49.- C50.- C51.- C52.- E4.1(MR) E4.3(GND) E10.14(VSS) E10.20(!CS) E16.14(VSS) E16.20(!CS) GND.1(P) ; also sheet 1,3,4
N$1: E7.5(C:I) PAD1.1(P)
N$3: E7.6(C:O) PAD2.1(P)
N$4: E15.9(D:I) PAD3.1(P)
N$6: E15.8(D:O) PAD4.1(P)
N$11: E38.11(B:A1) PAD5.1(P)
N$13: E38.13(B:A2) PAD6.1(P)
N$18: E38.15(B:A3) PAD7.1(P)
N$19: E38.19(B:G) PAD9.1(P)
N$28: E38.9(B:Y1) PAD10.1(P)
N$32: E38.7(B:Y2) PAD11.1(P)
N$36: E38.5(B:Y3) PAD16.1(P)
N$42: E38.3(B:Y4) PAD17.1(P)
N$43: E38.17(B:A4) PAD8.1(P)
N$44: E44.1 PAD18.1(P)
N$45: E44.2 PAD19.1(P)
N$46: E44.3 PAD20.1(P)
N$47: E44.4 PAD21.1(P)
N$54: E15.11(E:I) PAD12.1(P)
N$55: E15.10(E:O) PAD13.1(P)
N$56: E15.13(F:I) PAD14.1(P)
N$57: E15.12(F:O) PAD15.1(P)
N$58: E44.5 PAD22.1(P)
N$59: E44.6 PAD23.1(P)
N$60: E44.7 PAD24.1(P)
N$61: E44.8 PAD25.1(P)
N$62: E44.16 PAD26.1(P)
N$63: E44.15 PAD37.1(P)
N$64: E44.14 PAD38.1(P)
N$65: E44.13 PAD39.1(P)
N$66: E44.12 PAD40.1(P)
N$69: E44.11 PAD41.1(P)
N$70: E44.10 PAD45.1(P)
N$71: E3.3(B:I0) PAD27.1(P)
N$72: E3.4(B:I1) PAD28.1(P)
N$74: E3.5(B:I2) PAD29.1(P)
N$75: E3.6(B:O) PAD30.1(P)
N$76: E29.9(C:I0) PAD31.1(P)
N$77: E29.10(C:I1) PAD32.1(P)
N$78: E29.8(C:O) PAD33.1(P)
N$79: E29.12(D:I0) PAD34.1(P)
N$80: E29.13(D:I1) PAD35.1(P)
N$81: E29.11(D:O) PAD36.1(P)
N$82: E44.9 PAD46.1(P)
N$83: E13.1 PAD47.1(P)
N$84: E13.2 PAD48.1(P)
N$85: E13.3 PAD49.1(P)
N$86: E13.4 PAD50.1(P)
N$87: E39.12(D:I0) PAD42.1(P)
N$88: E39.13(D:I1) PAD43.1(P)
N$89: E39.11(D:O) PAD44.1(P)
N$90: E13.5 PAD51.1(P)
N$91: E13.6 PAD52.1(P)
N$92: E13.7 PAD53.1(P)
N$93: E13.8 PAD54.1(P)
N$95: E13.16 PAD55.1(P)
N$96: E13.15 PAD56.1(P)
N$97: E13.14 PAD57.1(P)
N$98: E13.13 PAD58.1(P)
N$99: E13.12 PAD59.1(P)
N$100: E13.11 PAD60.1(P)
N$101: E13.10 PAD61.1(P)
N$102: E13.9 PAD62.1(P)
VCC [Power]: C6.1 C7.1 C8.1 C9.1 C10.1 C11.1 C12.1 C13.1 C14.1 C15.1 C16.1 C17.1 C18.1 C19.1 C20.1 C21.1 C22.1 C23.1 C24.1 C25.1 C26.1 C27.1 C28.1 C29.1 C30.1 C31.1 C32.1 C33.1 C34.1 C35.1 C36.1 C37.1 C38.1 C39.1 C40.1 C41.1 C42.1 C43.1 C44.1 C45.1 C46.1 C47.1 C48.1 C49.+ C50.+ C51.+ C52.+ E4.2(VCC) E10.28(VCC) E16.28(VCC) VCC.1(P) ; also sheet 4
Unconnected: E10.18(I/O6) E10.19(I/O7) E16.18(I/O6) E16.19(I/O7)

### Notes on the sheet
- Spares:
- Unused Gates:
- Omnibus Memory Connectors

## Power pins joined to a net without a drawn wire
GND: E1.10(P:GND) E2.7(P:GND) E3.7(P:GND) E5.7(P:GND) E6.7(P:GND) E7.7(P:GND) E8.7(P:GND) E9.7(P:GND) E11.7(P:GND) E12.7(P:GND) E14.10(P:GND) E15.7(P:GND) E17.7(P:GND) E18.7(P:GND) E19.4(P:GND) E20.4(P:GND) E21.4(P:GND) E22.4(GND) E24.10(P:GND) E25.4(P:GND) E26.4(P:GND) E27.4(P:GND) E28.7(GND) E29.7(P:GND) E30.7(GND) E31.7(P:GND) E32.4(P:GND) E33.4(P:GND) E34.4(P:GND) E35.4(GND) E36.4(P:GND) E37.4(P:GND) E38.10(P:GND) E39.7(P:GND) E40.4(P:GND) E41.4(P:GND) E42.7(P:GND) E43.7(P:GND)
VCC: E1.20(P:VCC) E2.14(P:VCC) E3.14(P:VCC) E5.14(P:VCC) E6.14(P:VCC) E7.14(P:VCC) E8.14(P:VCC) E9.14(P:VCC) E11.14(P:VCC) E12.14(P:VCC) E14.20(P:VCC) E15.14(P:VCC) E17.14(P:VCC) E18.14(P:VCC) E19.8(P:VCC) E20.8(P:VCC) E21.8(P:VCC) E22.8(VCC) E24.20(P:VCC) E25.8(P:VCC) E26.8(P:VCC) E27.8(P:VCC) E28.14(VCC) E29.14(P:VCC) E30.14(VCC) E31.14(P:VCC) E32.8(P:VCC) E33.8(P:VCC) E34.8(P:VCC) E35.8(VCC) E36.8(P:VCC) E37.8(P:VCC) E38.20(P:VCC) E39.14(P:VCC) E40.8(P:VCC) E41.8(P:VCC) E42.14(P:VCC) E43.14(P:VCC)

## Library data of the parts
C2 C4-C48 = rcl:C-US: CAPACITOR, American symbol
C49-C52 = rcl:CPOL-US: POLARIZED CAPACITOR, American symbol
D2 D4 D5 = diode:1N4148: DIODE high speed (Philips)
E1 E14 E24 E38 = 74xx-us:74*240: Octal BUFFER and LINE DRIVER, 3-state
E2 E5 E6 E9 E12 E17 E18 E42 E43 = 74xx-us:74*74: Dual D type positive edge triggered FLIP FLOP, preset and clear
E3 E11 = 74xx-us:74*10: Triple 3-input NAND gate
E4 = maxim:MAX702CPA: POWER SUPPLY MONITOR; MF: MAXIM; MPN: MAX702CPA+; OC_FARNELL: 1188018; OC_NEWARK: 69K6744
E7 E15 = 74xx-us:74*04: Hex INVERTER
E8 E29 E31 E39 = 74xx-us:74*00: Quad 2-input NAND gate
E10 E16 = memory-hitachi:62256P: MEMORY; OC_FARNELL: unknown; OC_NEWARK: unknown
E13 E44 = ic-package:DIL16: Dual In Line / Socket
E19-E21 E25-E27 E32-E34 E36 E37 E40 E41 = dec-con:DS75453: OR PERIPHERAL DRIVERS FOR HIGH-CURRENT SWITCHING AT VERY HIGH SPEEDS Source: www.ti.com sn75452b.pdf
E22 E35 = maxim:MXD1000: DELAY LINE; OC_FARNELL: unknown; OC_NEWARK: unknown
E28 E30 = maxim:MXD1000P: DELAY LINE; OC_FARNELL: unknown; OC_NEWARK: unknown
GND VCC = wirepad:2,15/1,0: THROUGH-HOLE PAD
H01/H20 H02/H21 H03/H22 H04/H23 H05/H24 = con-lstb:MA17-2: PIN HEADER; OC_FARNELL: unknown; OC_NEWARK: unknown
JP1 JP3 = dec-con:JP2Q: JUMPER
JP2 JP4 = jumper:JP3Q: JUMPER
PAD1-PAD62 = wirepad:1,6/0,8: THROUGH-HOLE PAD
R15-R18 R21 R22 R27-R30 = rcl:R-US_: RESISTOR, American symbol

## Net classes
1 Power: width 0.889 mm